# EAGLE schematic main_15 (EAGLE 7.2.0)
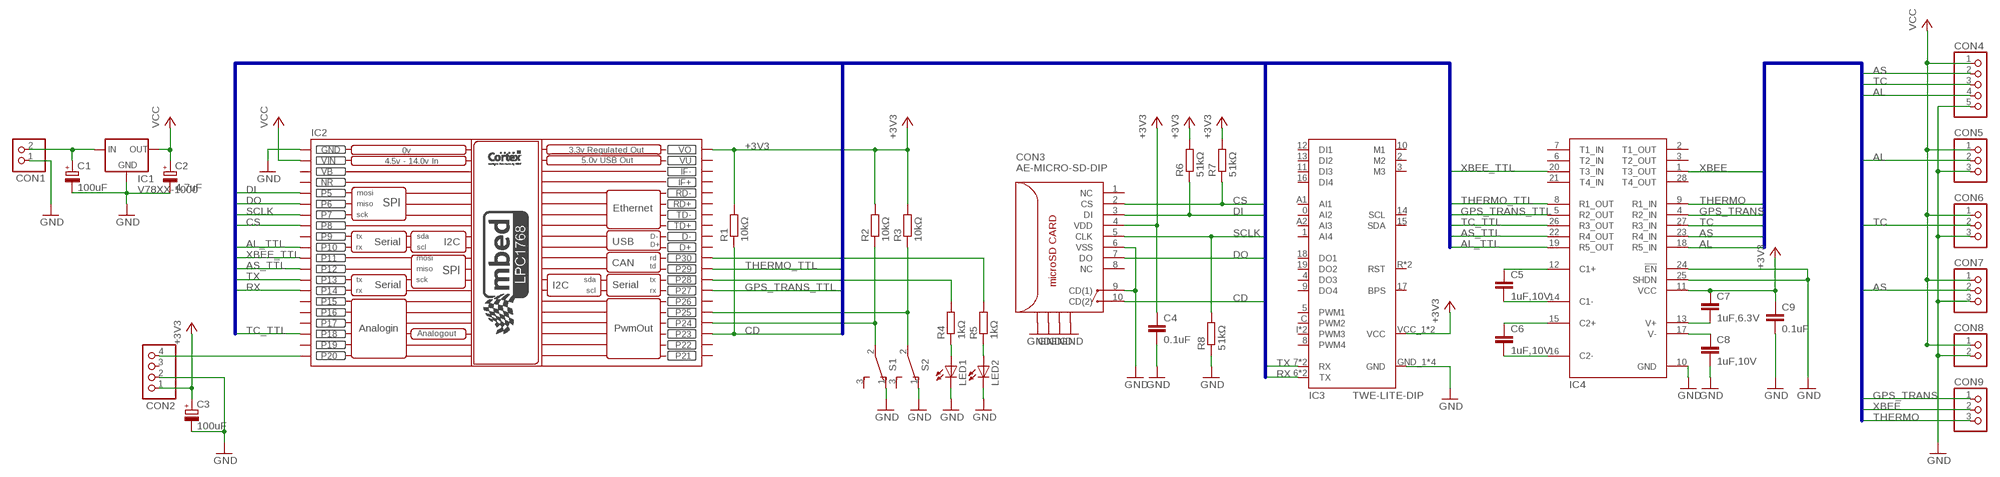
[diagram p0: schematic, sheet 1]

## Parts
C1  100uF  CPOL-EUE5-10.5  [E5-10,5]
C2  4.7uF  CPOL-EUE2.5-6  [E2,5-6]
C3  100uF  CPOL-EUE5-10.5  [E5-10,5]
C4  0.1uF  C-EU025-025X050  [C025-025X050]
C5  1uF,10V  C-EU025-025X050  [C025-025X050]
C6  1uF,10V  C-EU025-025X050  [C025-025X050]
C7  1uF,6.3V  C-EU025-025X050  [C025-025X050]
C8  1uF,10V  C-EU025-025X050  [C025-025X050]
C9  0.1uF  C-EU025-025X050  [C025-025X050]
CON1  2  [2]
CON2  PINHD-1X4  [1X04]
CON3  AE-MICRO-SD-DIP  [AE-MICRO-SD-DIP]
CON4  5  [5]
CON5  3  [3]
CON6  3  [3]
CON7  3  [3]
CON8  2  [2]
CON9  3  [3]
IC1  V78XX-1000  [V78XX-1000]
IC2  MBED_NXP_LPC1768  [MBED-KIT]
IC3  TWE-LITE-DIP  [TWE-LITE-DIP]
IC4  ADM561-DIP  [AE-SSOP-28]
LED1  LED3MM  [LED3MM]
LED2  LED3MM  [LED3MM]
R1  10kΩ  R-EU_0204/5  [0204/5]
R2  10kΩ  R-EU_0204/5  [0204/5]
R3  10kΩ  R-EU_0204/5  [0204/5]
R4  1kΩ  R-EU_0204/5  [0204/5]
R5  1kΩ  R-EU_0204/5  [0204/5]
R6  51kΩ  R-EU_0204/5  [0204/5]
R7  51kΩ  R-EU_0204/5  [0204/5]
R8  51kΩ  R-EU_0204/5  [0204/5]
S1  SS-12D00  [SS-12D00]
S2  SS-12D00  [SS-12D00]

## Nets
+3V3: C3.+ C4.1 C7.1 C9.1 CON2.1 CON3.4(VDD) IC2.VOUT(VO) IC3.VCC_1(VCC) IC3.VCC_2(VCC) IC4.11(VCC) R1.2 R2.2 R3.2 R6.2 R7.2
AL: CON4.4 CON5.2 IC4.18(R5_IN)
AL_TTL: IC2.P$10(P10) IC4.19(R5_OUT)
AS: CON4.2 CON7.2 IC4.23(R4_IN)
AS_TTL: IC2.P$12(P12) IC4.22(R4_OUT)
CD: CON3.10(CD(2)) IC2.P$23(P23) R1.1
CS: CON3.2(CS) IC2.P$8(P8) R7.1
DI: CON3.3(DI) IC2.P$5(P5) R6.1
DO: CON3.7(DO) IC2.P$6(P6)
GND: C1.- C2.- C3.- C4.2 C8.2 C9.2 CON1.1 CON2.2 CON3.6(VSS) CON3.9(CD(1)) CON3.NC1 CON3.NC2 CON3.NC3 CON3.NC4 CON3.NC5 CON3.NC6 CON3.NC7 CON3.NC8 CON4.5 CON5.3 CON6.3 CON7.3 CON8.2 IC1.2(GND) IC2.GND IC3.GND_1(GND) IC3.GND_2(GND) IC3.GND_3(GND) IC3.GND_4(GND) IC4.10(GND) IC4.24(!EN!) IC4.25(SHDN) LED1.K(C) LED2.K(C) R8.1 S1.1(O) S2.1(O)
GPS_TRANS: CON9.1 IC4.4(R2_IN)
GPS_TRANS_TTL: IC2.P$27(P27) IC4.5(R2_OUT)
N$1: C5.1 IC4.12(C1+)
N$2: C5.2 IC4.14(C1-)
N$3: C6.1 IC4.15(C2+)
N$4: C6.2 IC4.16(C2-)
N$5: C8.1 IC4.17(V-)
N$7: C7.2 IC4.13(V+)
N$19: CON2.4 IC2.P$20(P20)
N$20: IC2.P$25(P25) R3.1 S2.2(P)
N$21: IC2.P$24(P24) R2.1 S1.2(P)
N$23: IC2.P$28(P28) R4.2
N$24: LED1.A R4.1
N$25: IC2.P$30(P30) R5.2
N$26: LED2.A R5.1
N$27: C1.+ CON1.2 IC1.1(IN)
RX: IC2.P$14(P14) IC3.6(TX) IC3.TXD(TX)
SCLK: CON3.5(CLK) IC2.P$7(P7) R8.2
TC: CON4.3 CON6.2 IC4.27(R3_IN)
TC_TTL: IC2.P$18(P18) IC4.26(R3_OUT)
THERMO: CON9.3 IC4.9(R1_IN)
THERMO_TTL: IC2.P$29(P29) IC4.8(R1_OUT)
TX: IC2.P$13(P13) IC3.7(RX) IC3.RXD(RX)
VCC: C2.+ CON4.1 CON5.1 CON6.1 CON7.1 CON8.1 IC1.3(OUT) IC2.VIN
XBEE: CON9.2 IC4.1(T3_OUT)
XBEE_TTL: IC2.P$11(P11) IC4.20(T3_IN)
Unconnected: CON2.3 CON3.1(NC) CON3.8(NC) IC2.D+ IC2.D- IC2.IF+ IC2.IF- IC2.P$9(P9) IC2.P$15(P15) IC2.P$16(P16) IC2.P$17(P17) IC2.P$19(P19) IC2.P$21(P21) IC2.P$22(P22) IC2.P$26(P26) IC2.RD+ IC2.RD- IC2.TD+ IC2.TD- IC3.0(AI2) IC3.1(AI4) IC3.2(M2) IC3.3(M3) IC3.4(DO3) IC3.5(PWM1) IC3.8(PWM4) IC3.9(DO4) IC3.10(M1) IC3.11(DI3) IC3.12(DI1) IC3.13(DI2) IC3.14(SCL) IC3.15(SDA) IC3.16(DI4) IC3.17(BPS) IC3.18(DO1) IC3.19(DO2) IC3.A1(AI1) IC3.A2(AI3) IC3.C(PWM2) IC3.I(PWM3) IC3.PRG(PWM3) IC3.R(RST) IC3.RST IC4.2(T1_OUT) IC4.3(T2_OUT) IC4.6(T2_IN) IC4.7(T1_IN) IC4.21(T4_IN) IC4.28(T4_OUT) S1.3(S) S2.3(S)

## Buses
AS_TTL,TC_TTL,AL_TTL,GPS_TRANS_TTL,XBEE_TTL,THERMO_TTL,CS,DI,SCLK,CD,DO,RX,TX
AS,TC,AL,GPS_TRANS,XBEE,THERMO

## Power pins joined to a net without a drawn wire
NR: IC2.NR
VB: IC2.VB
VU: IC2.VU

## Library data of the parts
C1-C3 = rcl:CPOL-EU: POLARIZED CAPACITOR, European symbol
C4-C9 = rcl:C-EU: CAPACITOR, European symbol
CON1 CON8 = linehole:2
CON2 = pinhead:PINHD-1X4: PIN HEADER
CON3 = SD:AE-MICRO-SD-DIP
CON4 = linehole:5
CON5-CON7 CON9 = linehole:3
IC1 = v-reg:V78XX-1000: VOLTAGE REGULATOR
IC2 = MBED_v2.1:MBED_NXP_LPC1768: Mbed LPC1768 - ARM CORTEX v2.1 * Schematic symbol is now placed in eagles's default raster. *The pads diameter are suitable for routing between mbed pins * mbed pads are 0.8 mm drill diameter. --------------------------------------------- Created by: Mohamed Yousry *Alexandria, Egypt *Email: mohamed.yousry@ieeegoldegypt.org
IC3 = TWELite:TWE-LITE-DIP
IC4 = ADM561:ADM561-DIP
LED1 LED2 = led:LED: LED OSRAM: - CHIPLED LG R971, LG N971, LY N971, LG Q971, LY Q971, LO R971, LY R971 LH N974, LH R974 LS Q976, LO Q976, LY Q976 LO Q996 - Hyper CHIPLED LW Q18S LB Q993, LB Q99A, LB R99A - SideLED LS A670, LO A670, LY A670, LG A670, LP A670 LB A673, LV A673, LT A673, LW A673 LH A674 LY A675 LS A676, LA A676, LO A676, LY A676, LW A676 LS A679, LY A679, LG A679 - Hyper Micro SIDELED® LS Y876, LA Y876, LO Y876, LY Y876 LT Y87S - SmartLED LW L88C, LW L88S LB L89C, LB L89S, LG L890 LS L89K, LO L89K, LY L89K LS L896, LA L896, LO L896, LY L896 - TOPLED LS T670, LO T670, LY T670, LG T670, LP T670 LSG T670, LSP T670, LSY T670, LOP T670, LYG T670 LG T671, LOG T671, LSG T671 LB T673, LV T673, LT T673, LW T673 LH T674 LS T676, LA T676, LO T676, LY T676, LB T676, LH T676, LSB T676, LW T676 LB T67C, LV T67C, LT T67C, LS T67K, LO T67K, LY T67K, LW E67C LS E67B, LA E67B, LO E67B, LY E67B, LB E67C, LV E67C, LT E67C LW T67C LS T679, LY T679, LG T679 LS T770, LO T770, LY T770, LG T770, LP T770 LB T773, LV T773, LT T773, LW T773 LH T774 LS E675, LA E675, LY E675, LS T675 LS T776, LA T776, LO T776, LY T776, LB T776 LHGB T686 LT T68C, LB T68C - Hyper Mini TOPLED® LB M676 - Mini TOPLED Santana® LG M470 LS M47K, LO M47K, LY M47K Source: http://www.osram.convergy.de LUXEON: - LUMILED® LXK2-PW12-R00, LXK2-PW12-S00, LXK2-PW14-U00, LXK2-PW14-V00 LXK2-PM12-R00, LXK2-PM12-S00, LXK2-PM14-U00 LXK2-PE12-Q00, LXK2-PE12-R00, LXK2-PE12-S00, LXK2-PE14-T00, LXK2-PE14-U00 LXK2-PB12-K00, LXK2-PB12-L00, LXK2-PB12-M00, LXK2-PB14-N00, LXK2-PB14-P00, LXK2-PB14-Q00 LXK2-PR12-L00, LXK2-PR12-M00, LXK2-PR14-Q00, LXK2-PR14-R00 LXK2-PD12-Q00, LXK2-PD12-R00, LXK2-PD12-S00 LXK2-PH12-R00, LXK2-PH12-S00 LXK2-PL12-P00, LXK2-PL12-Q00, LXK2-PL12-R00 Source: www.luxeon.com KINGBRIGHT: KA-3528ASYC Source: www.kingbright.com
R1-R8 = rcl:R-EU_: RESISTOR, European symbol
S1 S2 = switch-slide:SS-12D00: SLIDE SWITCH